# Altium schematic sheet Jukebox Processing.SchDoc: Jukebox CPU and CPLD
size B; DrawnBy: Tim Menninger; Revision: 1.1; SheetNumber: 2; SheetTotal: 5
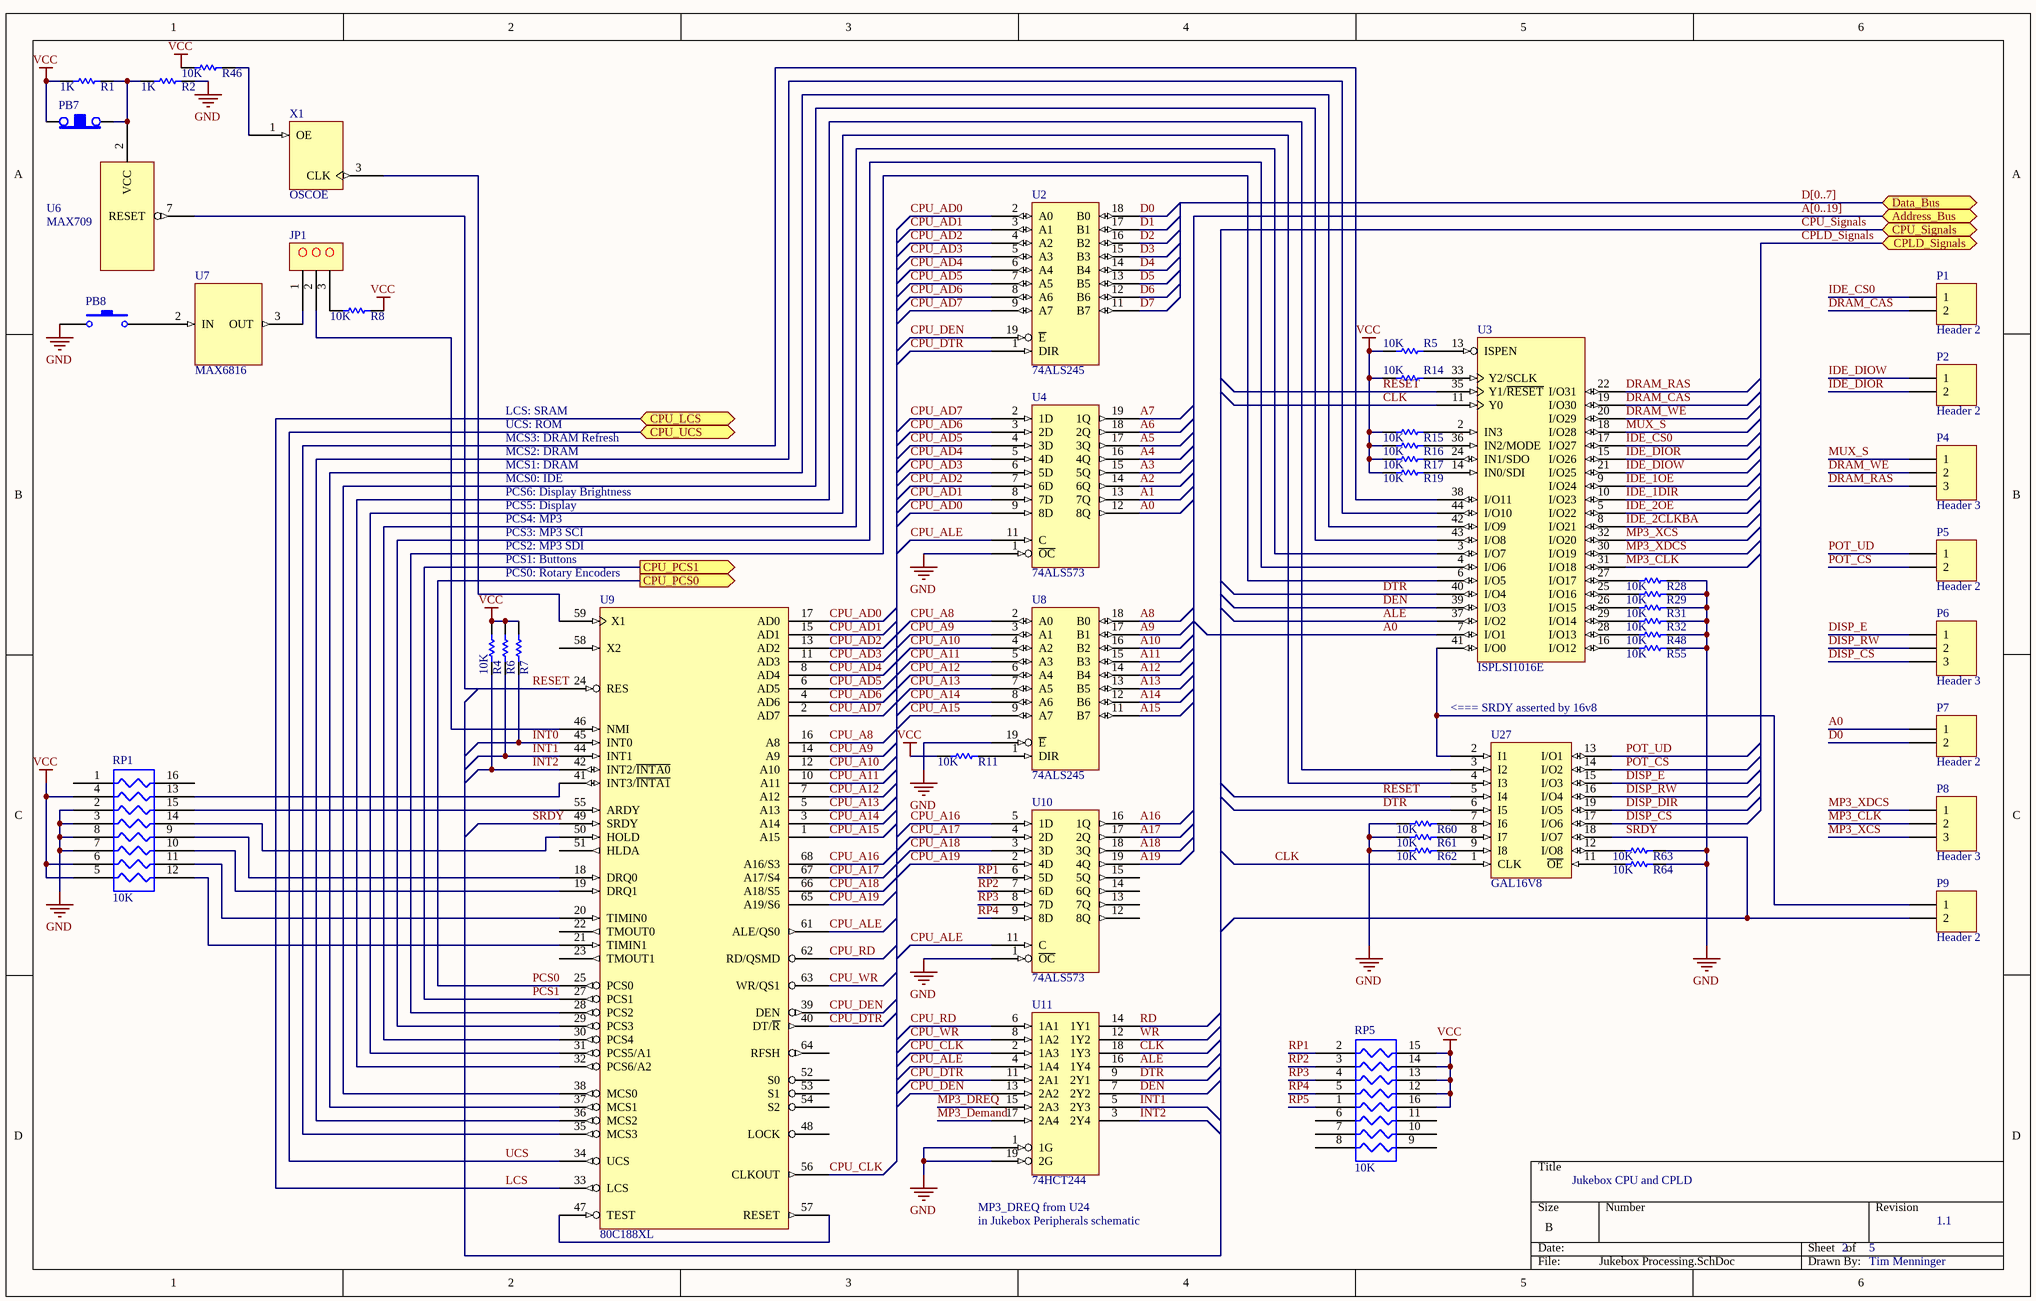
[diagram p0: Jukebox Processing.SchDoc]

## Parts
JP1  3P_JP  [HDR1X3]  (value not drawn)
P1  Header 2  [HDR1X2]
P2  Header 2  [HDR1X2]
P4  Header 3  [HDR1X3]
P5  Header 2  [HDR1X2]
P6  Header 3  [HDR1X3]
P7  Header 2  [HDR1X2]
P8  Header 3  [HDR1X3]
P9  Header 2  [HDR1X2]
PB7  SWITCH-PBNC  [KSR_PB_NC]  (value not drawn)
PB8  SW-PB  [KSR_PB_NC]  (value not drawn)
R1  value 1K  [6-0805_L]  (hidden comment: Res1)
R2  value 1K  [6-0805_L]  (hidden comment: Res1)
R4  value 10K  [6-0805_L]  (hidden comment: Res1)
R5  value 10K  [6-0805_L]  (hidden comment: Res1)
R6  Res1  [6-0805_L]  (value not drawn)
R7  Res1  [6-0805_L]  (value not drawn)
R8  value 10K  [6-0805_L]  (hidden comment: Res1)
R11  value 10K  [6-0805_L]  (hidden comment: Res1)
R14  value 10K  [6-0805_L]  (hidden comment: Res1)
R15  value 10K  [6-0805_L]  (hidden comment: Res1)
R16  value 10K  [6-0805_L]  (hidden comment: Res1)
R17  value 10K  [6-0805_L]  (hidden comment: Res1)
R19  value 10K  [6-0805_L]  (hidden comment: Res1)
R28  value 10K  [6-0805_L]  (hidden comment: Res1)
R29  value 10K  [6-0805_L]  (hidden comment: Res1)
R31  value 10K  [6-0805_L]  (hidden comment: Res1)
R32  value 10K  [6-0805_L]  (hidden comment: Res1)
R46  value 10K  [6-0805_L]  (hidden comment: Res1)
R48  value 10K  [6-0805_L]  (hidden comment: Res1)
R55  value 10K  [6-0805_L]  (hidden comment: Res1)
R60  value 10K  [6-0805_L]  (hidden comment: Res1)
R61  value 10K  [6-0805_L]  (hidden comment: Res1)
R62  value 10K  [6-0805_L]  (hidden comment: Res1)
R63  value 10K  [6-0805_L]  (hidden comment: Res1)
R64  value 10K  [6-0805_L]  (hidden comment: Res1)
RP1  10K  [SSOP16]
RP5  10K  [SSOP16]
U2  74ALS245  [SSOP20]
U3  ISPLSI1016E  [PLCCS44]
U4  74ALS573  [SSOP20]
U6  MAX709  [UMAX8]
U7  MAX6816  [SOT-143]
U8  74ALS245  [SSOP20]
U9  80C188XL  [PLCCS68I]
U10  74ALS573  [SSOP20]
U11  74HCT244  [SSOP20]
U27  GAL16V8  [DIPS20]
X1  OSCOE  [DIPS8-4]

## Ports
Address_Bus, CPLD_Signals, CPU_LCS, CPU_PCS0 (out), CPU_PCS1 (out), CPU_Signals, CPU_UCS, Data_Bus

## Nets
GND: PB8.1 R2.2 R28.2 R29.2 R31.2 R32.2 R48.2 R55.2 R60.1 R61.1 R62.1 R63.2 R64.2 RP1.2 RP1.3 RP1.7 RP1.8 U2.10(GND) U3.1(GND) U3.23(GND) U4.1(~{OC}) U4.10(GND) U6.3(GND) U7.1(GND) U8.10(GND) U8.19(~{E}) U9.26(GND) U9.60(GND) U10.1(~{OC}) U10.10(GND) U11.1(1G) U11.10(GND) U11.19(2G) U27.10(GND) X1.2(GND)
VCC: PB7.1 R1.1 R4.2 R5.1 R6.2 R7.2 R8.2 R11.1 R14.1 R15.1 R16.1 R17.1 R19.1 R46.1 RP1.4 RP1.5 RP1.6 RP5.12 RP5.13 RP5.14 RP5.15 RP5.16 U2.20(VCC) U3.12(VCC) U3.34(VCC) U4.20(VCC) U7.4(VCC) U8.20(VCC) U9.9(VCC) U9.43(VCC) U10.20(VCC) U11.20(VCC) U27.20(VCC) X1.4(VCC)
A0: P7.1 U3.7(I/O1) U4.12(8Q)
A1: U4.13(7Q)
A2: U4.14(6Q)
A3: U4.15(5Q)
A4: U4.16(4Q)
A5: U4.17(3Q)
A6: U4.18(2Q)
A7: U4.19(1Q)
A8: U8.18(B0)
A9: U8.17(B1)
A10: U8.16(B2)
A11: U8.15(B3)
A12: U8.14(B4)
A13: U8.13(B5)
A14: U8.12(B6)
A15: U8.11(B7)
A16: U10.16(1Q)
A17: U10.17(2Q)
A18: U10.18(3Q)
A19: U10.19(4Q)
ALE: U3.37(I/O2) U11.16(1Y4)
CLK: U3.11(Y0) U11.18(1Y3) U27.1(CLK)
CPU_A8: U8.2(A0) U9.16(A8)
CPU_A9: U8.3(A1) U9.14(A9)
CPU_A10: U8.4(A2) U9.12(A10)
CPU_A11: U8.5(A3) U9.10(A11)
CPU_A12: U8.6(A4) U9.7(A12)
CPU_A13: U8.7(A5) U9.5(A13)
CPU_A14: U8.8(A6) U9.3(A14)
CPU_A15: U8.9(A7) U9.1(A15)
CPU_A16: U9.68(A16/S3) U10.5(1D)
CPU_A17: U9.67(A17/S4) U10.4(2D)
CPU_A18: U9.66(A18/S5) U10.3(3D)
CPU_A19: U9.65(A19/S6) U10.2(4D)
CPU_AD0: U2.2(A0) U4.9(8D) U9.17(AD0)
CPU_AD1: U2.3(A1) U4.8(7D) U9.15(AD1)
CPU_AD2: U2.4(A2) U4.7(6D) U9.13(AD2)
CPU_AD3: U2.5(A3) U4.6(5D) U9.11(AD3)
CPU_AD4: U2.6(A4) U4.5(4D) U9.8(AD4)
CPU_AD5: U2.7(A5) U4.4(3D) U9.6(AD5)
CPU_AD6: U2.8(A6) U4.3(2D) U9.4(AD6)
CPU_AD7: U2.9(A7) U4.2(1D) U9.2(AD7)
CPU_ALE: U4.11(C) U9.61(ALE/QS0) U10.11(C) U11.4(1A4)
CPU_CLK: U9.56(CLKOUT) U11.2(1A3)
CPU_DEN: U2.19(~{E}) U9.39(DEN) U11.13(2A2)
CPU_DTR: U2.1(DIR) U9.40(DT/~{R}) U11.11(2A1)
CPU_RD: U9.62(RD/QSMD) U11.6(1A1)
CPU_WR: U9.63(WR/QS1) U11.8(1A2)
D0: P7.2 U2.18(B0)
D1: U2.17(B1)
D2: U2.16(B2)
D3: U2.15(B3)
D4: U2.14(B4)
D5: U2.13(B5)
D6: U2.12(B6)
D7: U2.11(B7)
DEN: U3.39(I/O3) U11.7(2Y2)
DISP_CS: P6.3 U27.17(I/O6)
DISP_DIR: U27.19(I/O5)
DISP_E: P6.1 U27.15(I/O3)
DISP_RW: P6.2 U27.16(I/O4)
DRAM_CAS: P1.2 U3.19(I/O30)
DRAM_RAS: P4.3 U3.22(I/O31)
DRAM_WE: P4.2 U3.20(I/O29)
DTR: U3.40(I/O4) U11.9(2Y1) U27.6(I5)
IDE_1DIR: U3.10(I/O23)
IDE_1OE: U3.9(I/O24)
IDE_2CLKBA: U3.8(I/O21)
IDE_2OE: U3.5(I/O22)
IDE_CS0: P1.1 U3.17(I/O27)
IDE_DIOR: P2.2 U3.15(I/O26)
IDE_DIOW: P2.1 U3.21(I/O25)
INT0: R7.1 U9.45(INT0)
INT1: R6.1 U9.44(INT1) U11.5(2Y3)
INT2: R4.1 U9.42(INT2/~{INTA0}) U11.3(2Y4)
LCS: U9.33(LCS) ; port CPU_LCS
MP3_CLK: P8.2 U3.31(I/O18)
MP3_Demand: U11.17(2A4)
MP3_DREQ: U11.15(2A3)
MP3_XCS: P8.3 U3.32(I/O20)
MP3_XDCS: P8.1 U3.30(I/O19)
MUX_S: P4.1 U3.18(I/O28)
PCS0: U9.25(PCS0) ; port CPU_PCS0
PCS1: U9.27(PCS1) ; port CPU_PCS1
POT_CS: P5.2 U27.14(I/O2)
POT_UD: P5.1 U27.13(I/O1)
RD: U11.14(1Y1)
RESET: U3.35(Y1/~{RESET}) U6.7(RESET) U9.24(RES) U27.5(I4)
RP1: RP5.2 U10.6(5D)
RP2: RP5.3 U10.7(6D)
RP3: RP5.4 U10.8(7D)
RP4: RP5.5 U10.9(8D)
RP5: RP5.1
SRDY: P9.2 U9.49(SRDY) U27.18(I/O7)
UCS: U9.34(UCS) ; port CPU_UCS
WR: U11.12(1Y2)
NetJP1_1: JP1.1 U7.3(OUT)
NetJP1_2: JP1.2 U9.46(NMI)
NetJP1_3: JP1.3 R8.1
NetP9_1: P9.1 U3.41(I/O0) U27.2(I1)
NetPB7_2: PB7.2 R1.2 R2.1 U6.2(VCC)
NetPB8_2: PB8.2 U7.2(IN)
NetR5_2: R5.2 U3.13(ISPEN)
NetR11_2: R11.2 U8.1(DIR)
NetR14_2: R14.2 U3.33(Y2/SCLK)
NetR15_2: R15.2 U3.2(IN3)
NetR16_2: R16.2 U3.36(IN2/MODE)
NetR17_2: R17.2 U3.24(IN1/SDO)
NetR19_2: R19.2 U3.14(IN0/SDI)
NetR28_1: R28.1 U3.27(I/O17)
NetR29_1: R29.1 U3.25(I/O16)
NetR31_1: R31.1 U3.26(I/O15)
NetR32_1: R32.1 U3.29(I/O14)
NetR46_2: R46.2 X1.1(OE)
NetR48_1: R48.1 U3.28(I/O13)
NetR55_1: R55.1 U3.16(I/O12)
NetR60_2: R60.2 U27.7(I6)
NetR61_2: R61.2 U27.8(I7)
NetR62_2: R62.2 U27.9(I8)
NetR63_1: R63.1 U27.12(I/O8)
NetR64_1: R64.1 U27.11(~{OE})
NetRP1_9: RP1.9 U9.18(DRQ0)
NetRP1_10: RP1.10 U9.19(DRQ1)
NetRP1_11: RP1.11 U9.20(TIMIN0)
NetRP1_12: RP1.12 U9.21(TIMIN1)
NetRP1_13: RP1.13 U9.41(INT3/~{INTA1})
NetRP1_14: RP1.14 U9.50(HOLD)
NetRP1_15: RP1.15 U9.55(ARDY)
NetU3_3: U3.3(I/O7) U9.30(PCS4)
NetU3_4: U3.4(I/O6) U9.29(PCS3)
NetU3_6: U3.6(I/O5) U9.28(PCS2)
NetU3_38: U3.38(I/O11) U9.35(MCS3)
NetU3_42: U3.42(I/O9) U9.37(MCS1)
NetU3_43: U3.43(I/O8) U9.38(MCS0)
NetU3_44: U3.44(I/O10) U9.36(MCS2)
NetU9_31: U9.31(PCS5/A1) U27.4(I3)
NetU9_32: U9.32(PCS6/A2) U27.3(I2)
NetU9_47: U9.47(TEST) U9.57(RESET)
NetU9_59: U9.59(X1) X1.3(CLK)

Not connected (* = marked no-connect by the designer): RP1 1 16; RP5 6 7 8 9 10 11; U9 22(TMOUT0) 23(TMOUT1) 48(LOCK) 51(HLDA) 52(S0) 53(S1) 54(S2) 58(X2) 64(RFSH); U10 12(8Q) 13(7Q) 14(6Q) 15(5Q)

## Buses and harness runs
bus A[0..19] = port Address_Bus
bus CPLD_Signals = port CPLD_Signals
bus CPU_Signals = port CPU_Signals
bus D[0..7] = port Data_Bus

## Notes on the sheet
- MCS3: DRAM Refresh
- UCS: ROM
- LCS: SRAM
- PCS6: Display Brightness
- PCS5: Display
- MCS0: IDE
- MCS2: DRAM
- MCS1: DRAM
- PCS1: Buttons
- PCS0: Rotary Encoders
- PCS2: MP3 SDI
- PCS4: MP3
- PCS3: MP3 SCI
- <=== SRDY asserted by 16v8
- (near U11) MP3_DREQ from U24
- in Jukebox Peripherals schematic

## Library data of the parts
P1 P2 P5 P7 P9 = Header 2: Header, 2-Pin; LatestRevisionDate: 17-Jul-2002; LatestRevisionNote: Re-released for DXP Platform.; Publisher: Altium Limited
P4 P6 P8 = Header 3: Header, 3-Pin; LatestRevisionDate: 17-Jul-2002; LatestRevisionNote: Re-released for DXP Platform.; Publisher: Altium Limited
PB7 = SWITCH-PBNC: Normally Closed Pushbutton Switch
PB8 = SW-PB: Switch; Published: 24-Mar-1999; LatestRevisionDate: 17-Jul-2002; LatestRevisionNote: Re-released for DXP Platform.; PackageReference: SPST-2; Publisher: Altium Limited; PackageDescription: Switch; 2 Leads
R1 R2 R4-R8 R11 R14-R17 R19 R28 R29 R31 R32 R46 R48 R55 R60-R64 = Res1: Resistor; Published: 8-Jun-2000; LatestRevisionDate: 17-Jul-2002; LatestRevisionNote: Re-released for DXP Platform.; PackageReference: AXIAL-0.3; Publisher: Altium Limited; PackageDescription: Axial Device, Thru-Hole; 2 Leads; 0.3 in Pin Spacing
RP1 RP5 = RPACK8: Resistor Pack - 8 Resistors
U2 U8 = 74ALS245: Octal Bus Transceiver
U3 = ISPLSI1016: In-System Programmable High Density CPLD
U4 U10 = 74ALS573: Octal Transparent Latch
U6 = MAX709: Maxim Power-On Reset
U7 = MAX6816: Single Switch Debouncer
U9 = 80C188XL: Intel 80188 Microprocessor
U11 = 74HCT244: Octal Buffer
X1 = OSCOE: Oscillator with Active High Output Enable